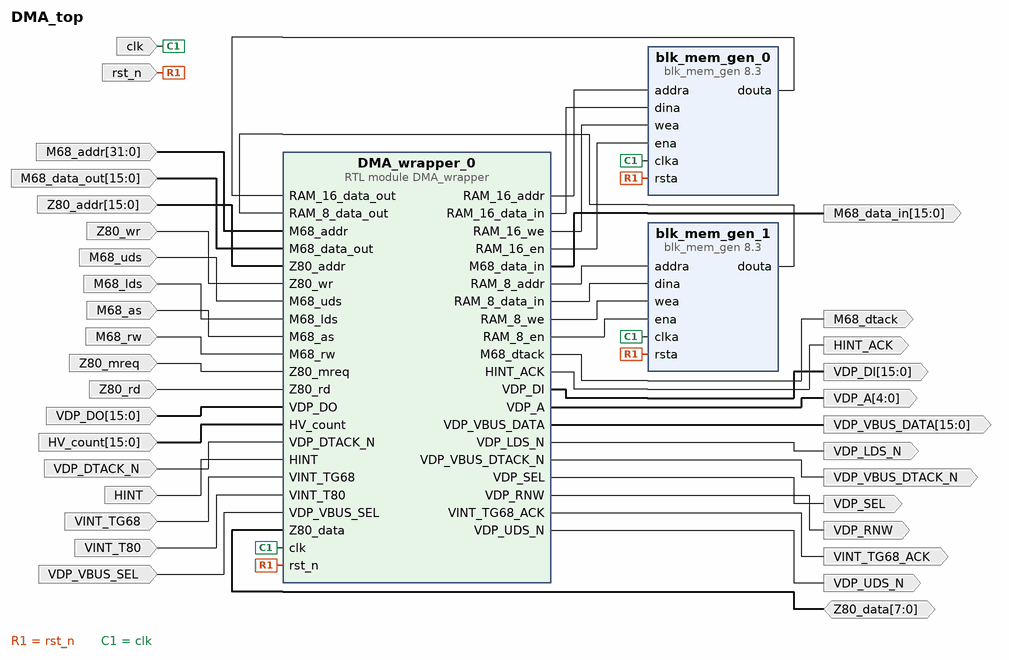
[diagram p0: block diagram of the top level]
# Vivado block design DMA_top, Vivado 2016.2
create_bd_design DMA_top

create_bd_port -dir I -type rst rst_n
create_bd_port -dir I -type clk clk
set_property -dict {CONFIG.FREQ_HZ 100000000} [get_bd_ports clk]
create_bd_port -dir I -from 31 -to 0 M68_addr
create_bd_port -dir I -from 15 -to 0 M68_data_out
create_bd_port -dir I -from 15 -to 0 Z80_addr
create_bd_port -dir I Z80_wr
create_bd_port -dir I M68_uds
create_bd_port -dir I M68_lds
create_bd_port -dir I M68_as
create_bd_port -dir I M68_rw
create_bd_port -dir I Z80_mreq
create_bd_port -dir I Z80_rd
create_bd_port -dir IO -from 7 -to 0 Z80_data
create_bd_port -dir O -from 15 -to 0 M68_data_in
create_bd_port -dir O M68_dtack
create_bd_port -dir I -from 15 -to 0 -type data VDP_DO
create_bd_port -dir I -from 15 -to 0 -type data HV_count
create_bd_port -dir I VDP_DTACK_N
create_bd_port -dir I HINT
create_bd_port -dir I VINT_TG68
create_bd_port -dir I VINT_T80
create_bd_port -dir I VDP_VBUS_SEL
create_bd_port -dir O -from 15 -to 0 -type data VDP_DI
create_bd_port -dir O -from 15 -to 0 -type data VDP_VBUS_DATA
create_bd_port -dir O -from 4 -to 0 -type data VDP_A
create_bd_port -dir O VDP_VBUS_DTACK_N
create_bd_port -dir O -type data VINT_TG68_ACK
create_bd_port -dir O HINT_ACK
create_bd_port -dir O VDP_SEL
create_bd_port -dir O VDP_UDS_N
create_bd_port -dir O VDP_LDS_N
create_bd_port -dir O VDP_RNW

create_bd_cell -type ip -vlnv xilinx.com:ip:blk_mem_gen:8.3 blk_mem_gen_0
set_property -dict [list \
  CONFIG.Enable_32bit_Address false \
  CONFIG.Use_Byte_Write_Enable false \
  CONFIG.Write_Width_A 16 \
  CONFIG.Write_Depth_A 4096 \
  CONFIG.Read_Width_A 16 \
  CONFIG.Register_PortA_Output_of_Memory_Primitives true \
  CONFIG.Use_RSTA_Pin true \
  CONFIG.use_bram_block Stand_Alone \
] [get_bd_cells blk_mem_gen_0]
create_bd_cell -type ip -vlnv xilinx.com:ip:blk_mem_gen:8.3 blk_mem_gen_1
set_property -dict [list \
  CONFIG.Enable_32bit_Address false \
  CONFIG.Use_Byte_Write_Enable false \
  CONFIG.Write_Width_A 8 \
  CONFIG.Write_Depth_A 1024 \
  CONFIG.Read_Width_A 8 \
  CONFIG.Register_PortA_Output_of_Memory_Primitives true \
  CONFIG.Register_PortA_Output_of_Memory_Core false \
  CONFIG.Use_RSTA_Pin true \
  CONFIG.use_bram_block Stand_Alone \
] [get_bd_cells blk_mem_gen_1]
create_bd_cell -type module -reference DMA_wrapper DMA_wrapper_0

# ---- connections ----

connect_bd_net [get_bd_ports rst_n] [get_bd_pins blk_mem_gen_0/rsta] [get_bd_pins blk_mem_gen_1/rsta] [get_bd_pins DMA_wrapper_0/rst_n]
connect_bd_net [get_bd_ports clk] [get_bd_pins blk_mem_gen_0/clka] [get_bd_pins blk_mem_gen_1/clka] [get_bd_pins DMA_wrapper_0/clk]
connect_bd_net [get_bd_pins DMA_wrapper_0/RAM_16_addr] [get_bd_pins blk_mem_gen_0/addra]
connect_bd_net [get_bd_pins DMA_wrapper_0/RAM_8_addr] [get_bd_pins blk_mem_gen_1/addra]
connect_bd_net [get_bd_pins DMA_wrapper_0/RAM_16_data_in] [get_bd_pins blk_mem_gen_0/dina]
connect_bd_net [get_bd_pins blk_mem_gen_0/douta] [get_bd_pins DMA_wrapper_0/RAM_16_data_out]
connect_bd_net [get_bd_pins blk_mem_gen_1/douta] [get_bd_pins DMA_wrapper_0/RAM_8_data_out]
connect_bd_net [get_bd_pins DMA_wrapper_0/RAM_8_data_in] [get_bd_pins blk_mem_gen_1/dina]
connect_bd_net [get_bd_pins DMA_wrapper_0/RAM_8_we] [get_bd_pins blk_mem_gen_1/wea]
connect_bd_net [get_bd_pins DMA_wrapper_0/RAM_16_we] [get_bd_pins blk_mem_gen_0/wea]
connect_bd_net [get_bd_pins DMA_wrapper_0/RAM_8_en] [get_bd_pins blk_mem_gen_1/ena]
connect_bd_net [get_bd_pins DMA_wrapper_0/RAM_16_en] [get_bd_pins blk_mem_gen_0/ena]
connect_bd_net [get_bd_ports M68_addr] [get_bd_pins DMA_wrapper_0/M68_addr]
connect_bd_net [get_bd_ports M68_data_out] [get_bd_pins DMA_wrapper_0/M68_data_out]
connect_bd_net [get_bd_ports Z80_addr] [get_bd_pins DMA_wrapper_0/Z80_addr]
connect_bd_net [get_bd_ports Z80_wr] [get_bd_pins DMA_wrapper_0/Z80_wr]
connect_bd_net [get_bd_ports M68_uds] [get_bd_pins DMA_wrapper_0/M68_uds]
connect_bd_net [get_bd_ports M68_lds] [get_bd_pins DMA_wrapper_0/M68_lds]
connect_bd_net [get_bd_ports M68_as] [get_bd_pins DMA_wrapper_0/M68_as]
connect_bd_net [get_bd_ports M68_rw] [get_bd_pins DMA_wrapper_0/M68_rw]
connect_bd_net [get_bd_ports Z80_mreq] [get_bd_pins DMA_wrapper_0/Z80_mreq]
connect_bd_net [get_bd_ports Z80_rd] [get_bd_pins DMA_wrapper_0/Z80_rd]
connect_bd_net [get_bd_ports Z80_data] [get_bd_pins DMA_wrapper_0/Z80_data]
connect_bd_net [get_bd_pins DMA_wrapper_0/M68_data_in] [get_bd_ports M68_data_in]
connect_bd_net [get_bd_pins DMA_wrapper_0/M68_dtack] [get_bd_ports M68_dtack]
connect_bd_net [get_bd_ports VDP_DO] [get_bd_pins DMA_wrapper_0/VDP_DO]
connect_bd_net [get_bd_ports HV_count] [get_bd_pins DMA_wrapper_0/HV_count]
connect_bd_net [get_bd_ports VDP_DTACK_N] [get_bd_pins DMA_wrapper_0/VDP_DTACK_N]
connect_bd_net [get_bd_ports HINT] [get_bd_pins DMA_wrapper_0/HINT]
connect_bd_net -net VINT_TG68_1 [get_bd_ports VINT_TG68] [get_bd_pins DMA_wrapper_0/VINT_TG68]
connect_bd_net -net VINT_T80_1 [get_bd_ports VINT_T80] [get_bd_pins DMA_wrapper_0/VINT_T80]
connect_bd_net [get_bd_ports VDP_VBUS_SEL] [get_bd_pins DMA_wrapper_0/VDP_VBUS_SEL]
connect_bd_net [get_bd_pins DMA_wrapper_0/VDP_DI] [get_bd_ports VDP_DI]
connect_bd_net [get_bd_pins DMA_wrapper_0/VDP_VBUS_DATA] [get_bd_ports VDP_VBUS_DATA]
connect_bd_net [get_bd_pins DMA_wrapper_0/VDP_VBUS_DTACK_N] [get_bd_ports VDP_VBUS_DTACK_N]
connect_bd_net [get_bd_pins DMA_wrapper_0/VDP_A] [get_bd_ports VDP_A]
connect_bd_net [get_bd_pins DMA_wrapper_0/VINT_TG68_ACK] [get_bd_ports VINT_TG68_ACK]
connect_bd_net [get_bd_pins DMA_wrapper_0/HINT_ACK] [get_bd_ports HINT_ACK]
connect_bd_net [get_bd_pins DMA_wrapper_0/VDP_SEL] [get_bd_ports VDP_SEL]
connect_bd_net [get_bd_pins DMA_wrapper_0/VDP_LDS_N] [get_bd_ports VDP_LDS_N]
connect_bd_net [get_bd_pins DMA_wrapper_0/VDP_UDS_N] [get_bd_ports VDP_UDS_N]
connect_bd_net [get_bd_pins DMA_wrapper_0/VDP_RNW] [get_bd_ports VDP_RNW]

validate_bd_design
save_bd_design
